# Altium project reflexios_back.PrjPcb
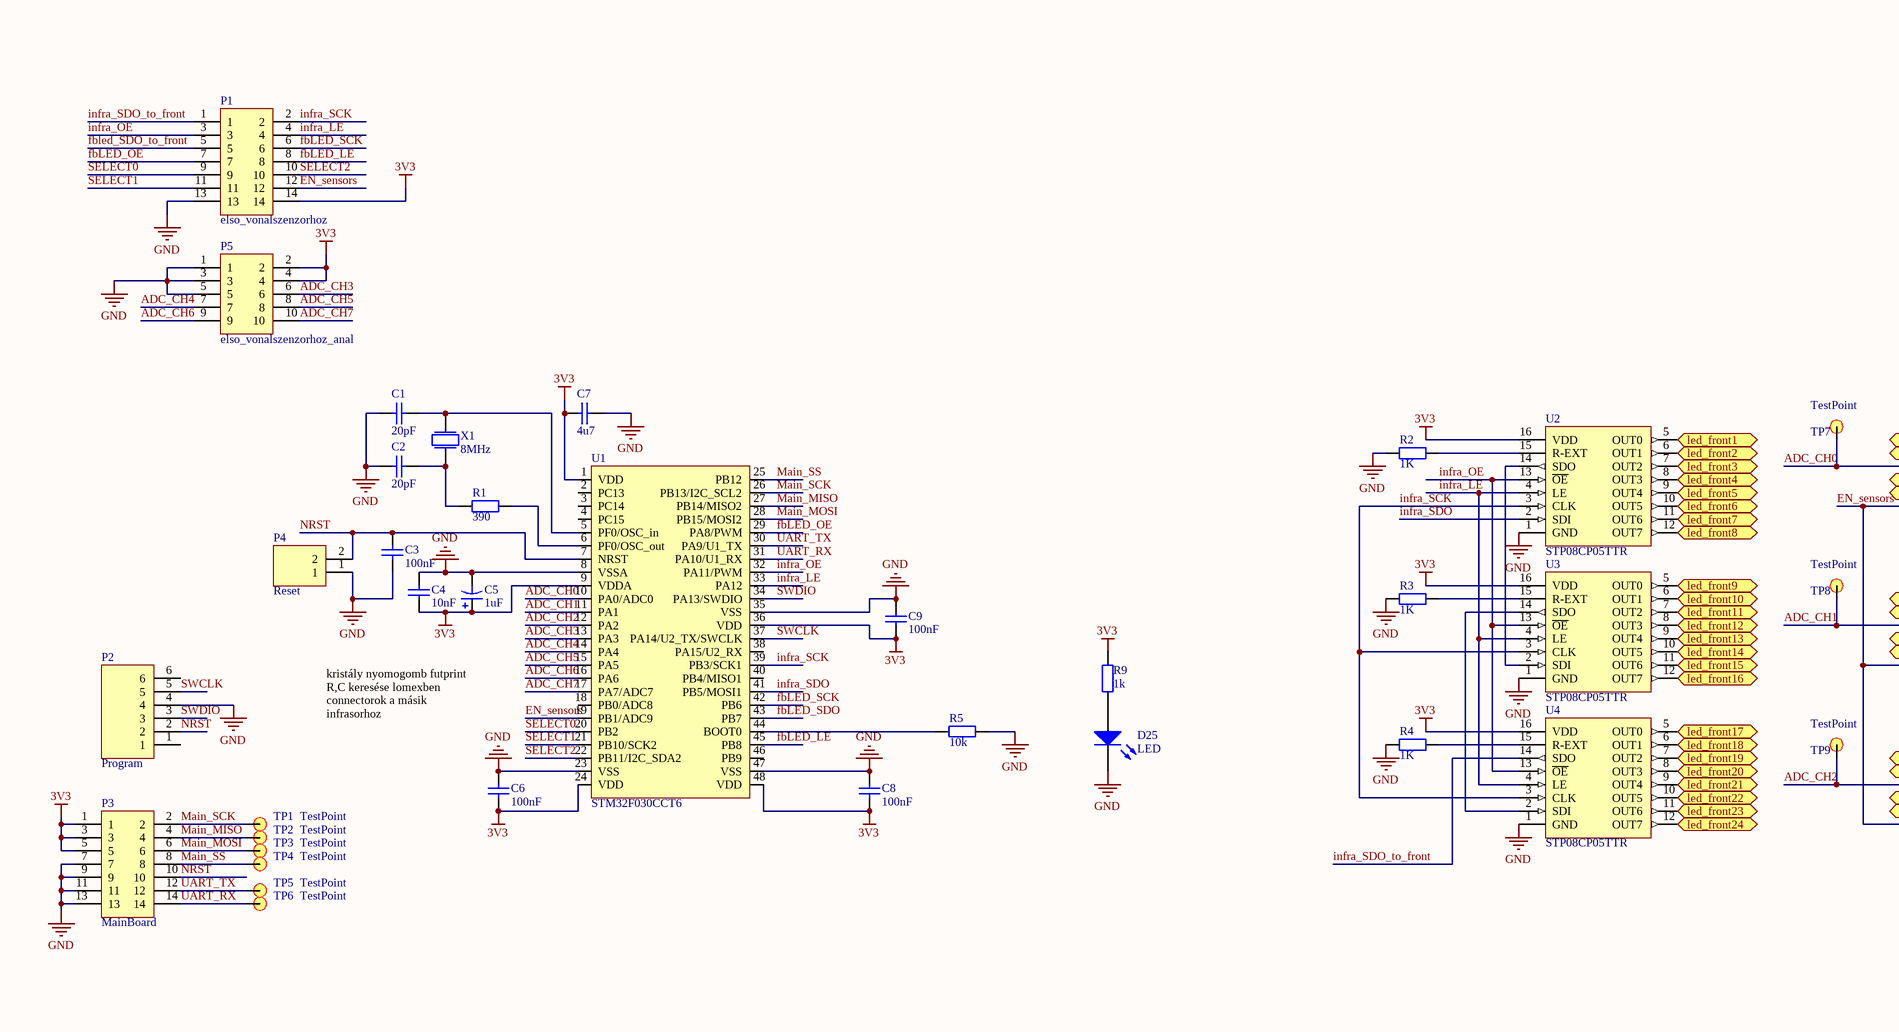
[diagram p0: back.SchDoc, left]
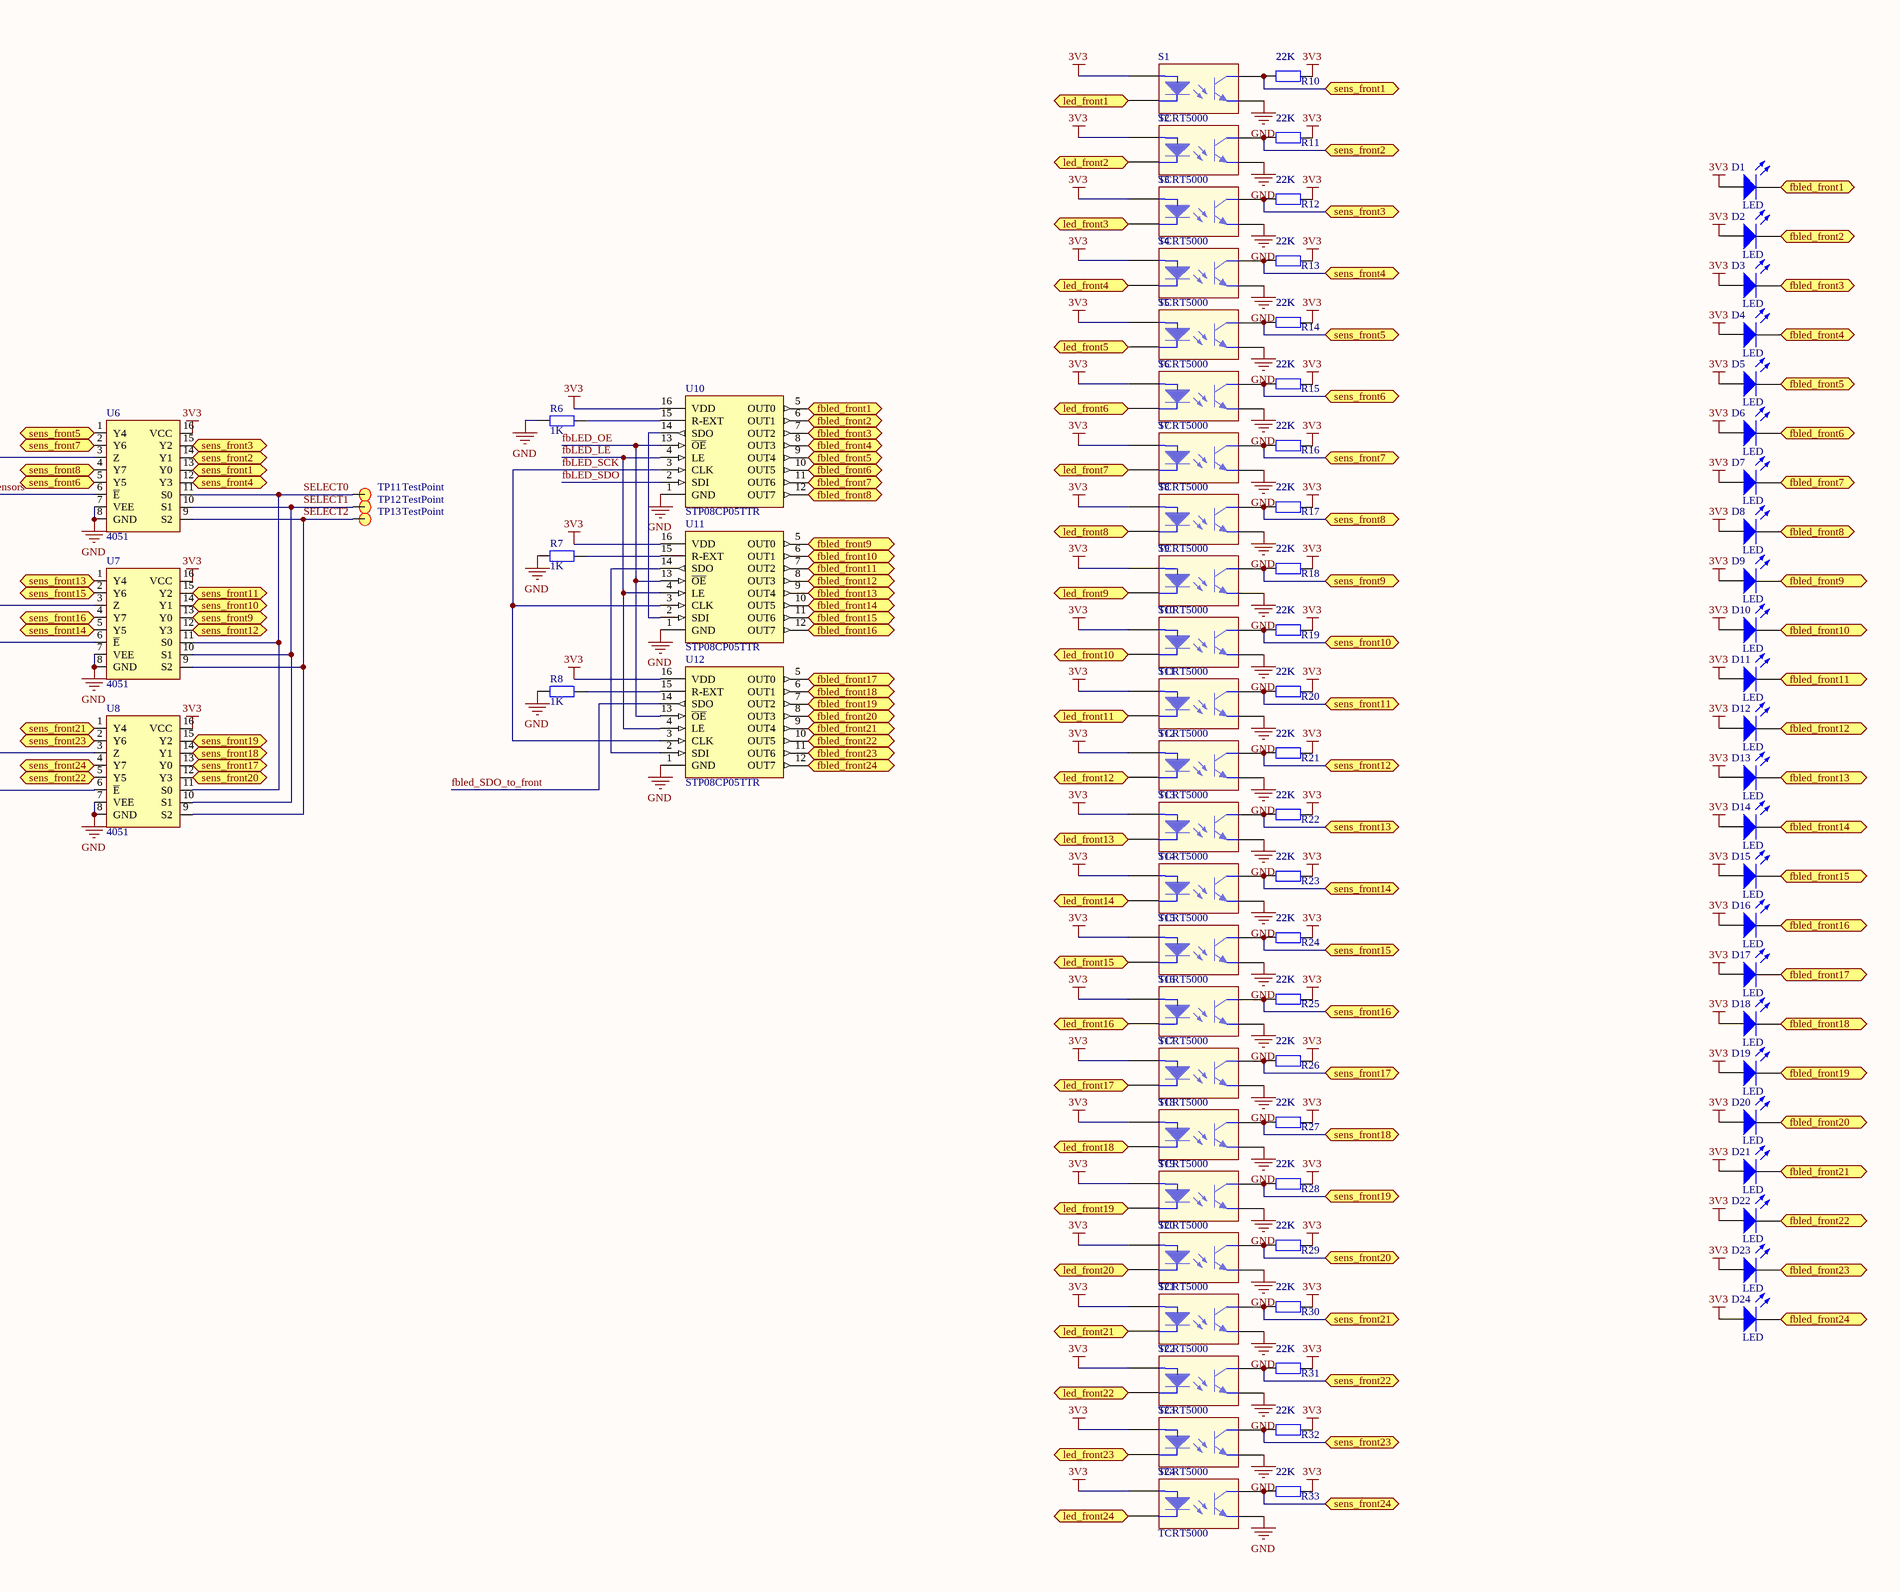
[diagram p1: back.SchDoc, right]
1 sheet, 119 parts. Net scope: flat (ports and power ports of the same name join across sheets).
Board file: 6C-2L-1550um.PcbDoc

## Sheet back.SchDoc
size A0

### Parts
C1  20pF  [FP_0805_CAP_085]
C2  20pF  [FP_0805_CAP_085]
C3  100nF  [FP_0805_CAP_085]
C4  10nF  [FP_0805_CAP_085]
C5  1uF  [FP_1206_CAP_160]
C6  100nF  [FP_0805_CAP_085]
C7  4u7  [FP_1206_CAP_125]
C8  100nF  [FP_0805_CAP_085]
C9  100nF  [FP_0805_CAP_085]
D1  LED  [FP_0805_LED_RED]
D2  LED  [FP_0805_LED_RED]
D3  LED  [FP_0805_LED_RED]
D4  LED  [FP_0805_LED_RED]
D5  LED  [FP_0805_LED_RED]
D6  LED  [FP_0805_LED_RED]
D7  LED  [FP_0805_LED_RED]
D8  LED  [FP_0805_LED_RED]
D9  LED  [FP_0805_LED_RED]
D10  LED  [FP_0805_LED_RED]
D11  LED  [FP_0805_LED_RED]
D12  LED  [FP_0805_LED_RED]
D13  LED  [FP_0805_LED_RED]
D14  LED  [FP_0805_LED_RED]
D15  LED  [FP_0805_LED_RED]
D16  LED  [FP_0805_LED_RED]
D17  LED  [FP_0805_LED_RED]
D18  LED  [FP_0805_LED_RED]
D19  LED  [FP_0805_LED_RED]
D20  LED  [FP_0805_LED_RED]
D21  LED  [FP_0805_LED_RED]
D22  LED  [FP_0805_LED_RED]
D23  LED  [FP_0805_LED_RED]
D24  LED  [FP_0805_LED_RED]
D25  LED  [FP_0805_LED_RED]
P1  elso_vonalszenzorhoz  [FP_CONN14]
P2  Program  [FP_CONN6_TAP_254MM]
P3  MainBoard  [FP_CONN14]
P4  Reset  [FP_CONN2_TAP_254MM]
P5  elso_vonalszenzorhoz_anal  [FP_CONN10]
R1  390  [FP_0805_RES]
R2  1K  [FP_1206_RES]
R3  1K  [FP_1206_RES]
R4  1K  [FP_1206_RES]
R5  10k  [FP_0805_RES]
R6  1K  [FP_1206_RES]
R7  1K  [FP_1206_RES]
R8  1K  [FP_1206_RES]
R9  1k  [FP_0805_RES]
R10  22K  [FP_1206_RES]
R11  22K  [FP_1206_RES]
R12  22K  [FP_1206_RES]
R13  22K  [FP_1206_RES]
R14  22K  [FP_1206_RES]
R15  22K  [FP_1206_RES]
R16  22K  [FP_1206_RES]
R17  22K  [FP_1206_RES]
R18  22K  [FP_1206_RES]
R19  22K  [FP_1206_RES]
R20  22K  [FP_1206_RES]
R21  22K  [FP_1206_RES]
R22  22K  [FP_1206_RES]
R23  22K  [FP_1206_RES]
R24  22K  [FP_1206_RES]
R25  22K  [FP_1206_RES]
R26  22K  [FP_1206_RES]
R27  22K  [FP_1206_RES]
R28  22K  [FP_1206_RES]
R29  22K  [FP_1206_RES]
R30  22K  [FP_1206_RES]
R31  22K  [FP_1206_RES]
R32  22K  [FP_1206_RES]
R33  22K  [FP_1206_RES]
S1  TCRT5000  [TCRT5000]
S2  TCRT5000  [TCRT5000]
S3  TCRT5000  [TCRT5000]
S4  TCRT5000  [TCRT5000]
S5  TCRT5000  [TCRT5000]
S6  TCRT5000  [TCRT5000]
S7  TCRT5000  [TCRT5000]
S8  TCRT5000  [TCRT5000]
S9  TCRT5000  [TCRT5000]
S10  TCRT5000  [TCRT5000]
S11  TCRT5000  [TCRT5000]
S12  TCRT5000  [TCRT5000]
S13  TCRT5000  [TCRT5000]
S14  TCRT5000  [TCRT5000]
S15  TCRT5000  [TCRT5000]
S16  TCRT5000  [TCRT5000]
S17  TCRT5000  [TCRT5000]
S18  TCRT5000  [TCRT5000]
S19  TCRT5000  [TCRT5000]
S20  TCRT5000  [TCRT5000]
S21  TCRT5000  [TCRT5000]
S22  TCRT5000  [TCRT5000]
S23  TCRT5000  [TCRT5000]
S24  TCRT5000  [TCRT5000]
TP1  TestPoint
TP2  TestPoint
TP3  TestPoint
TP4  TestPoint
TP5  TestPoint
TP6  TestPoint
TP7  TestPoint
TP8  TestPoint
TP9  TestPoint
TP11  TestPoint
TP12  TestPoint
TP13  TestPoint
U1  STM32F030CCT6  [STM32F030CCT6]
U2  STP08CP05TTR  [TSOP65P640X120-16M]
U3  STP08CP05TTR  [TSOP65P640X120-16M]
U4  STP08CP05TTR  [TSOP65P640X120-16M]
U6  4051  [SO16_N]
U7  4051  [SO16_N]
U8  4051  [SO16_N]
U10  STP08CP05TTR  [TSOP65P640X120-16M]
U11  STP08CP05TTR  [TSOP65P640X120-16M]
U12  STP08CP05TTR  [TSOP65P640X120-16M]
X1  8MHz  [FP_CRYSTAL_HC49]

### Ports
fbled_front1, fbled_front2, fbled_front3, fbled_front4, fbled_front5, fbled_front6, fbled_front7, fbled_front8, fbled_front9, fbled_front10, fbled_front11, fbled_front12, fbled_front13, fbled_front14, fbled_front15, fbled_front16, fbled_front17, fbled_front18, fbled_front19, fbled_front20, fbled_front21, fbled_front22, fbled_front23, fbled_front24, led_front1, led_front2, led_front3, led_front4, led_front5, led_front6, led_front7, led_front8, led_front9, led_front10, led_front11, led_front12, led_front13, led_front14, led_front15, led_front16, led_front17, led_front18, led_front19, led_front20, led_front21, led_front22, led_front23, led_front24, sens_front1, sens_front2, sens_front3, sens_front4, sens_front5, sens_front6, sens_front7, sens_front8, sens_front9, sens_front10, sens_front11, sens_front12, sens_front13, sens_front14, sens_front15, sens_front16, sens_front17, sens_front18, sens_front19, sens_front20, sens_front21, sens_front22, sens_front23, sens_front24

### Nets
3V3: C4.1 C5.P C6.1 C7.2 C8.1 C9.1 D1.1(A) D2.1(A) D3.1(A) D4.1(A) D5.1(A) D6.1(A) D7.1(A) D8.1(A) D9.1(A) D10.1(A) D11.1(A) D12.1(A) D13.1(A) D14.1(A) D15.1(A) D16.1(A) D17.1(A) D18.1(A) D19.1(A) D20.1(A) D21.1(A) D22.1(A) D23.1(A) D24.1(A) P1.14 P3.1 P3.3 P3.5 P5.2 P5.4 R9.2 R10.2 R11.2 R12.2 R13.2 R14.2 R15.2 R16.2 R17.2 R18.2 R19.2 R20.2 R21.2 R22.2 R23.2 R24.2 R25.2 R26.2 R27.2 R28.2 R29.2 R30.2 R31.2 R32.2 R33.2 S1.1(A) S2.1(A) S3.1(A) S4.1(A) S5.1(A) S6.1(A) S7.1(A) S8.1(A) S9.1(A) S10.1(A) S11.1(A) S12.1(A) S13.1(A) S14.1(A) S15.1(A) S16.1(A) S17.1(A) S18.1(A) S19.1(A) S20.1(A) S21.1(A) S22.1(A) S23.1(A) S24.1(A) U1.1(VDD) U1.9(VDDA) U1.24(VDD) U1.36(VDD) U1.48(VDD) U2.16(VDD) U3.16(VDD) U4.16(VDD) U6.16(VCC) U7.16(VCC) U8.16(VCC) U10.16(VDD) U11.16(VDD) U12.16(VDD)
GND: C1.2 C2.2 C3.1 C4.2 C5.N C6.2 C7.1 C8.2 C9.2 D25.2(K) P1.13 P2.4 P3.7 P3.9 P3.11 P3.13 P4.1 P5.1 P5.3 P5.5 R2.1 R3.1 R4.1 R5.2 R6.1 R7.1 R8.1 S1.4(E) S2.4(E) S3.4(E) S4.4(E) S5.4(E) S6.4(E) S7.4(E) S8.4(E) S9.4(E) S10.4(E) S11.4(E) S12.4(E) S13.4(E) S14.4(E) S15.4(E) S16.4(E) S17.4(E) S18.4(E) S19.4(E) S20.4(E) S21.4(E) S22.4(E) S23.4(E) S24.4(E) U1.8(VSSA) U1.23(VSS) U1.35(VSS) U1.47(VSS) U2.1(GND) U3.1(GND) U4.1(GND) U6.7(VEE) U6.8(GND) U7.7(VEE) U7.8(GND) U8.7(VEE) U8.8(GND) U10.1(GND) U11.1(GND) U12.1(GND)
ADC_CH0: TP7.1 U1.10(PA0/ADC0) U6.3(Z)
ADC_CH1: TP8.1 U1.11(PA1) U7.3(Z)
ADC_CH2: TP9.1 U1.12(PA2) U8.3(Z)
ADC_CH3: P5.6 U1.13(PA3)
ADC_CH4: P5.7 U1.14(PA4)
ADC_CH5: P5.8 U1.15(PA5)
ADC_CH6: P5.9 U1.16(PA6)
ADC_CH7: P5.10 U1.17(PA7/ADC7)
EN_sensors: P1.12 U1.19(PB1/ADC9) U6.6(~{E}) U7.6(~{E}) U8.6(~{E})
fbLED_LE: P1.8 U1.45(PB8) U10.4(LE) U11.4(LE) U12.4(LE)
fbLED_OE: P1.7 U1.29(PA8/PWM) U10.13(~{OE}) U11.13(~{OE}) U12.13(~{OE})
fbLED_SCK: P1.6 U1.42(PB6) U10.3(CLK) U11.3(CLK) U12.3(CLK)
fbLED_SDO: U1.43(PB7) U10.2(SDI)
fbled_SDO_to_front: P1.5 U12.14(SDO)
infra_LE: P1.4 U1.33(PA12) U2.4(LE) U3.4(LE) U4.4(LE)
infra_OE: P1.3 U1.32(PA11/PWM) U2.13(~{OE}) U3.13(~{OE}) U4.13(~{OE})
infra_SCK: P1.2 U1.39(PB3/SCK1) U2.3(CLK) U3.3(CLK) U4.3(CLK)
infra_SDO: U1.41(PB5/MOSI1) U2.2(SDI)
infra_SDO_to_front: P1.1 U4.14(SDO)
Main_MISO: P3.4 TP2.1 U1.27(PB14/MISO2)
Main_MOSI: P3.6 TP3.1 U1.28(PB15/MOSI2)
Main_SCK: P3.2 TP1.1 U1.26(PB13/I2C_SCL2)
Main_SS: P3.8 TP4.1 U1.25(PB12)
NRST: C3.2 P2.2 P3.10 P4.2 U1.7(NRST)
SELECT0: P1.9 TP11.1 U1.20(PB2) U6.11(S0) U7.11(S0) U8.11(S0)
SELECT1: P1.11 TP12.1 U1.21(PB10/SCK2) U6.10(S1) U7.10(S1) U8.10(S1)
SELECT2: P1.10 TP13.1 U1.22(PB11/I2C_SDA2) U6.9(S2) U7.9(S2) U8.9(S2)
SWCLK: P2.5 U1.37(PA14/U2_TX/SWCLK)
SWDIO: P2.3 U1.34(PA13/SWDIO)
UART_RX: P3.14 TP6.1 U1.31(PA10/U1_RX)
UART_TX: P3.12 TP5.1 U1.30(PA9/U1_TX)
NetC1_1: C1.1 U1.5(PF0/OSC_in) X1.2
NetC2_1: C2.1 R1.1 X1.1
NetD1_2: D1.2(K) U10.5(OUT0) ; port fbled_front1
NetD2_2: D2.2(K) U10.6(OUT1) ; port fbled_front2
NetD3_2: D3.2(K) U10.7(OUT2) ; port fbled_front3
NetD4_2: D4.2(K) U10.8(OUT3) ; port fbled_front4
NetD5_2: D5.2(K) U10.9(OUT4) ; port fbled_front5
NetD6_2: D6.2(K) U10.10(OUT5) ; port fbled_front6
NetD7_2: D7.2(K) U10.11(OUT6) ; port fbled_front7
NetD8_2: D8.2(K) U10.12(OUT7) ; port fbled_front8
NetD9_2: D9.2(K) U11.5(OUT0) ; port fbled_front9
NetD10_2: D10.2(K) U11.6(OUT1) ; port fbled_front10
NetD11_2: D11.2(K) U11.7(OUT2) ; port fbled_front11
NetD12_2: D12.2(K) U11.8(OUT3) ; port fbled_front12
NetD13_2: D13.2(K) U11.9(OUT4) ; port fbled_front13
NetD14_2: D14.2(K) U11.10(OUT5) ; port fbled_front14
NetD15_2: D15.2(K) U11.11(OUT6) ; port fbled_front15
NetD16_2: D16.2(K) U11.12(OUT7) ; port fbled_front16
NetD17_2: D17.2(K) U12.5(OUT0) ; port fbled_front17
NetD18_2: D18.2(K) U12.6(OUT1) ; port fbled_front18
NetD19_2: D19.2(K) U12.7(OUT2) ; port fbled_front19
NetD20_2: D20.2(K) U12.8(OUT3) ; port fbled_front20
NetD21_2: D21.2(K) U12.9(OUT4) ; port fbled_front21
NetD22_2: D22.2(K) U12.10(OUT5) ; port fbled_front22
NetD23_2: D23.2(K) U12.11(OUT6) ; port fbled_front23
NetD24_2: D24.2(K) U12.12(OUT7) ; port fbled_front24
NetD25_1: D25.1(A) R9.1
NetR1_2: R1.2 U1.6(PF0/OSC_out)
NetR2_2: R2.2 U2.15(R-EXT)
NetR3_2: R3.2 U3.15(R-EXT)
NetR4_2: R4.2 U4.15(R-EXT)
NetR5_1: R5.1 U1.44(BOOT0)
NetR6_2: R6.2 U10.15(R-EXT)
NetR7_2: R7.2 U11.15(R-EXT)
NetR8_2: R8.2 U12.15(R-EXT)
NetR10_1: R10.1 S1.3(C) U6.13(Y0) ; port sens_front1
NetR11_1: R11.1 S2.3(C) U6.14(Y1) ; port sens_front2
NetR12_1: R12.1 S3.3(C) U6.15(Y2) ; port sens_front3
NetR13_1: R13.1 S4.3(C) U6.12(Y3) ; port sens_front4
NetR14_1: R14.1 S5.3(C) U6.1(Y4) ; port sens_front5
NetR15_1: R15.1 S6.3(C) U6.5(Y5) ; port sens_front6
NetR16_1: R16.1 S7.3(C) U6.2(Y6) ; port sens_front7
NetR17_1: R17.1 S8.3(C) U6.4(Y7) ; port sens_front8
NetR18_1: R18.1 S9.3(C) U7.13(Y0) ; port sens_front9
NetR19_1: R19.1 S10.3(C) U7.14(Y1) ; port sens_front10
NetR20_1: R20.1 S11.3(C) U7.15(Y2) ; port sens_front11
NetR21_1: R21.1 S12.3(C) U7.12(Y3) ; port sens_front12
NetR22_1: R22.1 S13.3(C) U7.1(Y4) ; port sens_front13
NetR23_1: R23.1 S14.3(C) U7.5(Y5) ; port sens_front14
NetR24_1: R24.1 S15.3(C) U7.2(Y6) ; port sens_front15
NetR25_1: R25.1 S16.3(C) U7.4(Y7) ; port sens_front16
NetR26_1: R26.1 S17.3(C) U8.13(Y0) ; port sens_front17
NetR27_1: R27.1 S18.3(C) U8.14(Y1) ; port sens_front18
NetR28_1: R28.1 S19.3(C) U8.15(Y2) ; port sens_front19
NetR29_1: R29.1 S20.3(C) U8.12(Y3) ; port sens_front20
NetR30_1: R30.1 S21.3(C) U8.1(Y4) ; port sens_front21
NetR31_1: R31.1 S22.3(C) U8.5(Y5) ; port sens_front22
NetR32_1: R32.1 S23.3(C) U8.2(Y6) ; port sens_front23
NetR33_1: R33.1 S24.3(C) U8.4(Y7) ; port sens_front24
NetS1_2: S1.2(K) U2.5(OUT0) ; port led_front1
NetS2_2: S2.2(K) U2.6(OUT1) ; port led_front2
NetS3_2: S3.2(K) U2.7(OUT2) ; port led_front3
NetS4_2: S4.2(K) U2.8(OUT3) ; port led_front4
NetS5_2: S5.2(K) U2.9(OUT4) ; port led_front5
NetS6_2: S6.2(K) U2.10(OUT5) ; port led_front6
NetS7_2: S7.2(K) U2.11(OUT6) ; port led_front7
NetS8_2: S8.2(K) U2.12(OUT7) ; port led_front8
NetS9_2: S9.2(K) U3.5(OUT0) ; port led_front9
NetS10_2: S10.2(K) U3.6(OUT1) ; port led_front10
NetS11_2: S11.2(K) U3.7(OUT2) ; port led_front11
NetS12_2: S12.2(K) U3.8(OUT3) ; port led_front12
NetS13_2: S13.2(K) U3.9(OUT4) ; port led_front13
NetS14_2: S14.2(K) U3.10(OUT5) ; port led_front14
NetS15_2: S15.2(K) U3.11(OUT6) ; port led_front15
NetS16_2: S16.2(K) U3.12(OUT7) ; port led_front16
NetS17_2: S17.2(K) U4.5(OUT0) ; port led_front17
NetS18_2: S18.2(K) U4.6(OUT1) ; port led_front18
NetS19_2: S19.2(K) U4.7(OUT2) ; port led_front19
NetS20_2: S20.2(K) U4.8(OUT3) ; port led_front20
NetS21_2: S21.2(K) U4.9(OUT4) ; port led_front21
NetS22_2: S22.2(K) U4.10(OUT5) ; port led_front22
NetS23_2: S23.2(K) U4.11(OUT6) ; port led_front23
NetS24_2: S24.2(K) U4.12(OUT7) ; port led_front24
NetU2_14: U2.14(SDO) U3.2(SDI)
NetU3_14: U3.14(SDO) U4.2(SDI)
NetU10_14: U10.14(SDO) U11.2(SDI)
NetU11_14: U11.14(SDO) U12.2(SDI)

Not connected (* = marked no-connect by the designer): P2 1 6; U1 2(PC13) 3(PC14) 4(PC15) 18(PB0/ADC8) 38(PA15/U2_RX) 40(PB4/MISO1) 46(PB9)

### Notes on the sheet
- (near C6) kristály nyomogomb futprint
  R,C keresése lomexben
  connectorok a másik infrasorhoz

### Library data of the parts
C1-C4 C6-C9 = CAP: Capacitor
  C1 C2: Value: 20pF
  C3 C6 C8 C9: Value: 100nF
  C4: Value: 10nF
  C7: Value: 4u7
C5 = CAP_ELECT: Polarized Capacitor; pin to pad: N>2 P>1; Value: 1uF
D1-D25 = LED: Typical RED GaAs LED; pin to pad: 1>A 2>K
P1 P3 = Connector_14pin: 14pin Connector
P2 = Connector_6pin: 6pin connector
P4 = Connector_2pin: 2pin connector
P5 = Connector_10pin: 10pin Connector
R1-R9 = RES: Resistor
  R1: Value: 390
  R2-R4 R6-R8: Value: 1K
  R5: Value: 10k
  R9: Value: 1k
R10-R33 = Res2: Resistor; Name: 22K0 1206 1% WR12X2202FTL 0.25W (WAL); Value: 22K; Supplier: Lomex; Reference: 80-42-61
S1-S24 = TCRT5000: Reflective Optical Sensor; Reference: 1470066; Name: TCRT5000 -  Reflective Photo Interrupter, Phototransistor, Through Hole, 15 mm, 60 mA, 5 Vr, 1.25 Vf; Supplier: Farnell
TP1-TP9 TP11-TP13 = TestPoint: 1pin testpoint
U2-U4 U10-U12 = STP08CP05TTR: Low voltage, low current power 8-bit shift register
U6-U8 = 74HC4051: 8:1 analog mux; Name: 74HC4051D (NXP) 8-INPUT ANALOG MULTIPLEXER/DEMULTIPLEXER SO-16 MUX/DEMUX; Reference: 87-05-61; Supplier: Lomex
X1 = Crystal: Quarz Crystal; Value: 8MHz
U1 = STM32F030CCT6: Name: STM32F030CCT6; Reference: *; Supplier: Farnell